# Altium project PCB_Project.PrjPcb (part 2 of 2)

## Sheet Button-connections.SchDoc
size A4; SheetNumber: 5; SheetTotal: 6
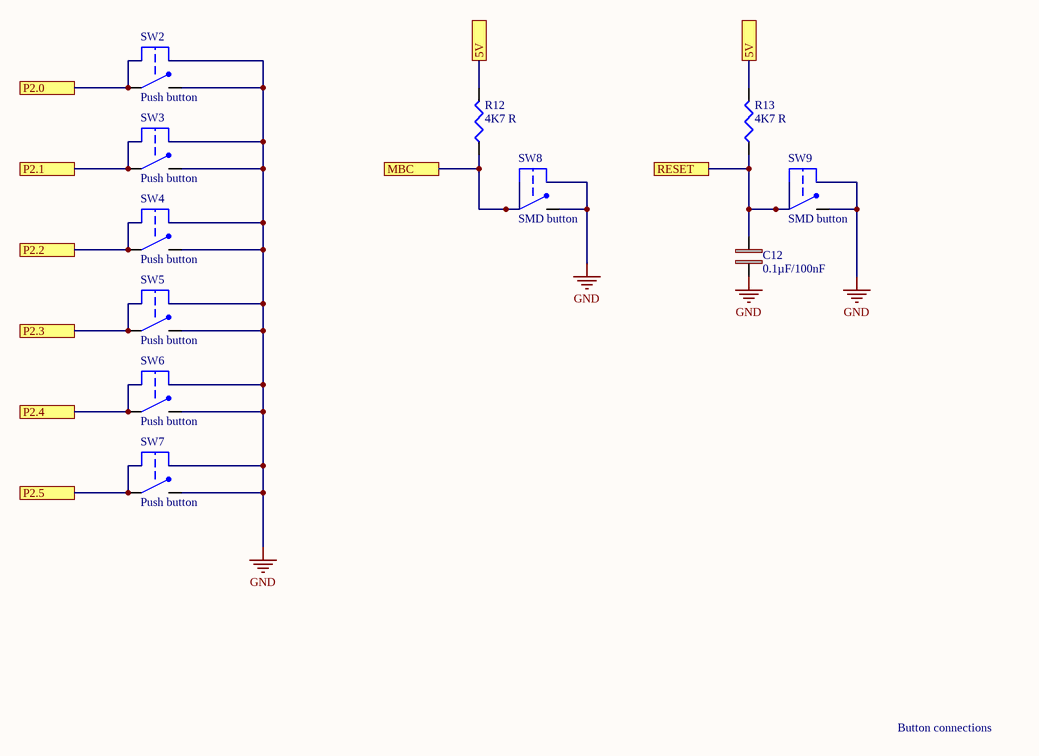
[diagram p4: Button-connections.SchDoc]

### Parts
C12  0.1µF/100nF  [MC0603B104K250CT]
R12  4K7 R  [PCF0603]
R13  4K7 R  [PCF0603]
SW2  Push button  [Tactile button]
SW3  Push button  [Tactile button]
SW4  Push button  [Tactile button]
SW5  Push button  [Tactile button]
SW6  Push button  [Tactile button]
SW7  Push button  [Tactile button]
SW8  SMD button  [TACTILE BUTTON - duplicate]
SW9  SMD button  [TACTILE BUTTON - duplicate]

### Ports
5V, MBC, P2.0, P2.1, P2.2, P2.3, P2.4, P2.5, RESET

### Nets
GND: C12.2 SW2.3 SW2.4 SW3.3 SW3.4 SW4.3 SW4.4 SW5.3 SW5.4 SW6.3 SW6.4 SW7.3 SW7.4 SW8.3 SW8.4 SW9.3 SW9.4
NetC4_1: R12.2 R13.2 ; port 5V
NetC12_1: C12.1 R13.1 SW9.1 SW9.2 ; port RESET
NetIC6_22: SW2.1 SW2.2 ; port P2.0
NetIC6_23: SW3.1 SW3.2 ; port P2.1
NetIC6_24: SW4.1 SW4.2 ; port P2.2
NetIC6_27: SW5.1 SW5.2 ; port P2.3
NetIC6_28: SW6.1 SW6.2 ; port P2.4
NetIC6_29: SW7.1 SW7.2 ; port P2.5
NetIC6_58: R12.1 SW8.1 SW8.2 ; port MBC

### Notes on the sheet
- Button connections

### Library data of the parts
C12 = MC0603B104K250CT: Cap Ceramic 0.1uF 25V X7R 10% Pad SMD 0603 125C T/R; Manufacturer: Multicomp; Capacitance: 100nF; Supplier 1: Newark; Manufacturer Part Number: MC0603B104K250CT; RoHS: Yes; Category: Ceramic Capacitors; Stock 1: 124000; Pricing 1: 1=0,00300, 4000=0,00300, 8000=0,00300, 20000=0,00300 (USD); Case/Package: 0603; Number of Pins: 2; Case Code (Metric): 1608; Case Code (Imperial): 0603; Min Operating Temperature: -55°C; Max Operating Temperature: 125°C; Tolerance: 10%; Packaging: Cut Tape; Voltage Rating: 25V; Dielectric: X7R; Voltage Rating (DC): 25V; Series: MLCC; Width: 0.8mm; REACH SVHC: Unknown; RoHS Compliant: Yes; ComponentLink1URL: https://datasheet.ciiva.com/22686/1901289-22686277.pdf?src-supplier=Element14; ComponentLink1Description: https://datasheet.ciiva.com/22686/1901289-22686277.pdf?src-supplier=Element14; ComponentLink2URL: https://datasheet.ciiva.com/22648/1901289-22648410.pdf?src-supplier=Element14; ComponentLink2Description: https://datasheet.ciiva.com/22648/1901289-22648410.pdf?src-supplier=Element14; Supplier Part Number 1: 94W8728
R12 R13 = PCF0603P-R-4K7-BT1: Surface Mount Metal Film Resistor, Pcf Series, 4.7 Kohm, 63 Mw, - 0.1%, 75 V Rohs Compliant: Yes; Manufacturer: TT Welwyn; Power Rating: 63mW; Voltage Rating: 75V; Resistance: 4.7kR; Temperature Coefficient: 25ppm/°C; Case/Category: 0603; Supplier 1: Newark; Manufacturer Part Number: PCF0603P-R-4K7-BT1; RoHS: Yes; Category: Chip SMD Resistors; Stock 1: 1027; Pricing 1: 10=0,17900 (USD); Case Code (Imperial): 0603; Case Code (Metric): 1608; Tolerance: 0.1%; Packaging: Cut Tape; Resistor Type: Thin Film; Voltage Rating (DC): 75V; REACH SVHC: No SVHC; ComponentLink1URL: https://datasheet.ciiva.com/7860/3754-7860191.pdf?src-supplier=Element14; ComponentLink1Description: https://datasheet.ciiva.com/7860/3754-7860191.pdf?src-supplier=Element14; ComponentLink2URL: https://datasheet.ciiva.com/6093/3754-6093381.pdf?src-supplier=Farnell; ComponentLink2Description: https://datasheet.ciiva.com/6093/3754-6093381.pdf?src-supplier=Farnell; Supplier Part Number 1: 61M8292
SW2-SW7 = EVQ-PAG05R: Switch Tactile N.O. SPST Round Button PC Pins 0.02A 15VDC 2.6N Thru-Hole Bulk; Manufacturer: Panasonic; Mechanical Life: 50000Cycles; Actuator Color: Red; Max Voltage Rating (DC): 15V; Illumination Type: Non-Illuminated; Switch Function: Off-Mom; Actuator Type: Standard; Current Rating: 20mA; Contact Resistance: 50mR; Switch Travel: 0.25mm; Actuator Length: 1.6mm; Supplier 1: RSComponents; Manufacturer Part Number: EVQ-PAG05R; RoHS: Yes; Category: Tactile Switches; Stock 1: 1; Pricing 1: 50=0,24100, 500=0,18100 (USD); Mount: Through Hole; Contact Plating: Silver; Min Operating Temperature: -20°C; Max Operating Temperature: 70°C; Throw Configuration: SPST; Packaging: Bulk; Operating Force: 2.6N; Package Quantity: 500; Termination: PC Pin; Voltage Rating (DC): 15V; Max Current Rating: 20mA; Contact Current Rating: 20mA; Electrical Life: 50000Cycles; Orientation: Straight; Series: EVQPA; Length: 6mm; Width: 6mm; Height: 5mm; Depth: 6.5mm; Size: 6mm; Radiation Hardening: No; Lead Free: Lead Free; REACH SVHC: No SVHC; RoHS Compliant: Yes; ComponentLink1URL: https://datasheet.ciiva.com/1634/1520560-1634709.pdf?src-supplier=Farnell; ComponentLink1Description: https://datasheet.ciiva.com/1634/1520560-1634709.pdf?src-supplier=Farnell; ComponentLink2URL: https://datasheet.ciiva.com/25603/0900766b810ad3e5-25603994.pdf?src-supplier=RSComponents; ComponentLink2Description: https://datasheet.ciiva.com/25603/0900766b810ad3e5-25603994.pdf?src-supplier=RSComponents; ComponentLink3URL: https://datasheet.ciiva.com/1532/1520560-1532790.pdf?src-supplier=Element14; ComponentLink3Description: https://datasheet.ciiva.com/1532/1520560-1532790.pdf?src-supplier=Element14; ComponentLink4URL: https://datasheet.ciiva.com/24086/atk0000ce10-33274-24086442.pdf?src-supplier=Mouser; ComponentLink4Description: https://datasheet.ciiva.com/24086/atk0000ce10-33274-24086442.pdf?src-supplier=Mouser; ComponentLink5URL: https://datasheet.ciiva.com/2901/atk0000ce10-2901437.pdf?src-supplier=Digi-Key; ComponentLink5Description: https://datasheet.ciiva.com/2901/atk0000ce10-2901437.pdf?src-supplier=Digi-Key; ComponentLink6URL: https://datasheet.ciiva.com/30192/36atk0000ce10-30192373.pdf?src-supplier=Onlinecomponents.com; ComponentLink6Description: https://datasheet.ciiva.com/30192/36atk0000ce10-30192373.pdf?src-supplier=Onlinecomponents.com; ComponentLink7URL: https://datasheet.ciiva.com/8166/atk0000ce10-8166366.pdf?src-supplier=Avnet; ComponentLink7Description: https://datasheet.ciiva.com/8166/atk0000ce10-8166366.pdf?src-supplier=Avnet; ComponentLink8URL: https://datasheet.ciiva.com/16976/70270700-16976175.pdf?src-supplier=Allied+Electronics; ComponentLink8Description: https://datasheet.ciiva.com/16976/70270700-16976175.pdf?src-supplier=Allied+Electronics; Supplier Part Number 1: 7561543P
SW8 SW9 = EVQ-PLMA15: Switch Tactile N.O. SPST Round Button J-Bend 0.02A 15VDC 2.6N SMD Embossed Tape; Manufacturer: Panasonic; Mechanical Life: 200000Cycles; Max Voltage Rating (DC): 15V; Current Rating: 20mA; Contact Resistance: 50mR; Illumination Type: Non-Illuminated,Illuminated; Switch Travel: 0.25mm; Switch Function: Off-Mom; Actuator Type: Standard; Actuator Length: 0.3mm; Supplier 1: Newark; Manufacturer Part Number: EVQ-PLMA15; RoHS: Yes; Category: Tactile Switches; Stock 1: 5000; Pricing 1: 1=0,18600, 5000=0,18600, 10000=0,18000, 25000=0,17700, 50000=0,17500 (USD); Mount: Surface Mount; Contact Plating: Gold,Silver; Min Operating Temperature: -20°C; Max Operating Temperature: 70°C; Throw Configuration: SPST; Operating Force: 2.6N; Termination: J-Bend; Voltage Rating (DC): 15V; Packaging: Tape and Reel; Package Quantity: 1; Max Current Rating: 20mA; Electrical Life: 200000Cycles; Orientation: Straight; Contact Current Rating: 20mA; Voltage Rating: 15V; Insulation Resistance: 50MR; Length: 4.9mm; Width: 4.9mm; Height: 1.5mm; Depth: 4.9mm; Radiation Hardening: No; REACH SVHC: No SVHC; Lead Free: Lead Free; ComponentLink1URL: https://datasheet.ciiva.com/8164/atv0000ce2-8164994.pdf?src-supplier=Avnet; ComponentLink1Description: https://datasheet.ciiva.com/8164/atv0000ce2-8164994.pdf?src-supplier=Avnet; ComponentLink2URL: https://datasheet.ciiva.com/16205/atk0000ce3-16205767.pdf?src-supplier=Future+Electronics; ComponentLink2Description: https://datasheet.ciiva.com/16205/atk0000ce3-16205767.pdf?src-supplier=Future+Electronics; ComponentLink3URL: https://datasheet.ciiva.com/17065/70270715-17065721.pdf?src-supplier=Allied+Electronics; ComponentLink3Description: https://datasheet.ciiva.com/17065/70270715-17065721.pdf?src-supplier=Allied+Electronics; ComponentLink4URL: https://datasheet.ciiva.com/2899/atk0000ce3-2899834.pdf?src-supplier=Digi-Key; ComponentLink4Description: https://datasheet.ciiva.com/2899/atk0000ce3-2899834.pdf?src-supplier=Digi-Key; ComponentLink5URL: https://datasheet.ciiva.com/2899/atk0000ce3-2899835.pdf?src-supplier=Digi-Key; ComponentLink5Description: https://datasheet.ciiva.com/2899/atk0000ce3-2899835.pdf?src-supplier=Digi-Key; ComponentLink6URL: https://datasheet.ciiva.com/2899/atk0000ce3-2899836.pdf?src-supplier=Digi-Key; ComponentLink6Description: https://datasheet.ciiva.com/2899/atk0000ce3-2899836.pdf?src-supplier=Digi-Key; ComponentLink7URL: https://datasheet.ciiva.com/26827/getdatasheetpartid-51835-26827884.pdf?src-supplier=Verical; ComponentLink7Description: https://datasheet.ciiva.com/26827/getdatasheetpartid-51835-26827884.pdf?src-supplier=Verical; Supplier Part Number 1: 27AC5577

## Sheet Interfaces.SchDoc
size A4; SheetNumber: 6; SheetTotal: 6
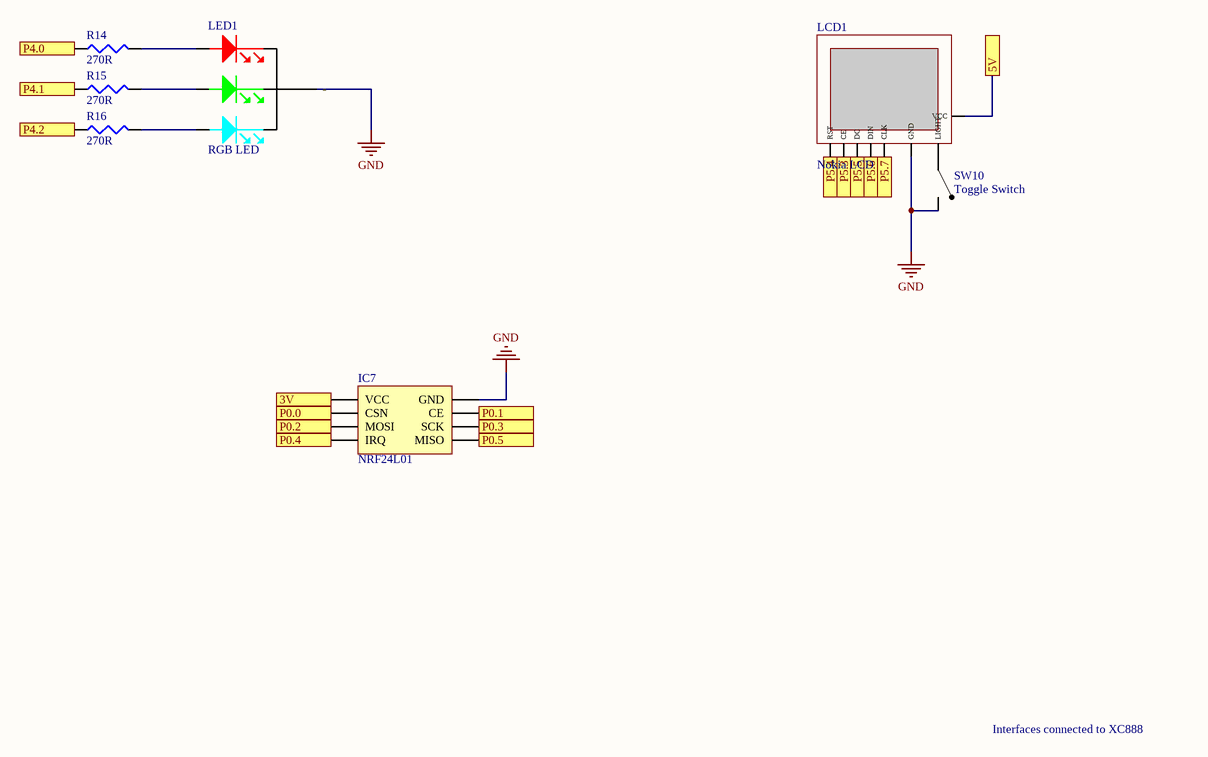
[diagram p5: Interfaces.SchDoc]

### Parts
IC7  NRF24L01  [NRF header]
LCD1  Nokia LCD  [LCD header]
LED1  RGB LED  [4 PIN - RGB LED]
R14  270R  [CRG0402F]
R15  270R  [CRG0402F]
R16  270R  [CRG0402F]
SW10  Toggle Switch  [SMD Switch]

### Ports
3V, 5V, P0.0, P0.1, P0.2, P0.3, P0.4, P0.5, P4.0, P4.1, P4.2, P5.3, P5.4, P5.5, P5.6, P5.7

### Nets
GND: IC7.2(GND) LCD1.8(GND) LED1.2(-) SW10.2
NetBAT_1: IC7.1(VCC) ; port 3V
NetC4_1: LCD1.6(VCC) ; port 5V
NetIC6_1: IC7.8(MISO) ; port P0.5
NetIC6_13: LCD1.2(CE) ; port P5.3
NetIC6_14: LCD1.1(RST) ; port P5.4
NetIC6_15: LCD1.3(DC) ; port P5.5
NetIC6_17: IC7.3(CSN) ; port P0.0
NetIC6_18: IC7.5(MOSI) ; port P0.2
NetIC6_19: LCD1.4(DIN) ; port P5.6
NetIC6_20: LCD1.5(CLK) ; port P5.7
NetIC6_21: IC7.4(CE) ; port P0.1
NetIC6_59: R14.1 ; port P4.0
NetIC6_60: R15.1 ; port P4.1
NetIC6_61: R16.1 ; port P4.2
NetIC6_63: IC7.6(SCK) ; port P0.3
NetIC6_64: IC7.7(IRQ) ; port P0.4
NetLCD1_7: LCD1.7(LIGHT) SW10.1
NetLED1_1: LED1.1 R16.2
NetLED1_3: LED1.3 R15.2
NetLED1_4: LED1.4 R14.2

### Notes on the sheet
- Interfaces connected to XC888

### Library data of the parts
IC7 = NRF24L01 Module
LCD1 = Nokia 5110 LCD: Category: LCD Display
LED1 = WP154A4SUREQBFZGC: Hyper Red/Green/Blue 50º Water Clear Full Color LED Lamp - T-1 3/4; Manufacturer: Kingbright; Color: Blue,Green,Red; Forward Voltage: 4V; Viewing Angle: 60°; Luminous Intensity: 500mcd; Lens Style: Dome; Test Current: 20mA; Dominant Wavelength: 465nm; Power Rating: 120mW; Reverse Voltage (DC): 5V; Supplier 1: Digi-Key; Manufacturer Part Number: WP154A4SUREQBFZGC; RoHS: Yes; Category: LEDs; Stock 1: 39551; Pricing 1: 1=1,98000, 10=1,25100, 100=0,92560, 500=0,85054, 1000=0,70800 (USD); Mount: Through Hole; Case/Package: Radial; Weight: 0.01411oz; Min Operating Temperature: -40°C; Max Operating Temperature: 85°C; Packaging: Bulk; Package Quantity: 500; Forward Current: 20mA; Lens Transparency: Clear; Operating Supply Voltage: 4V; Height: 8.6mm; RoHS Compliant: Yes; Lead Free: Lead Free; ComponentLink1URL: https://datasheet.ciiva.com/6349/wp154a4sureqbfzgc-6349426.pdf?src-supplier=Digi-Key; ComponentLink1Description: https://datasheet.ciiva.com/6349/wp154a4sureqbfzgc-6349426.pdf?src-supplier=Digi-Key; ComponentLink2URL: https://datasheet.ciiva.com/13501/wp154a4sureqbfzgc-194997-13501708.pdf?src-supplier=Mouser; ComponentLink2Description: https://datasheet.ciiva.com/13501/wp154a4sureqbfzgc-194997-13501708.pdf?src-supplier=Mouser; Supplier Part Number 1: 754-1615-ND
R14-R16 = CRG0402F270R: Res Thick Film 0402 270 Ohm 1% 0.063W(1/16W) ±100ppm/C Pad SMD T/R; Manufacturer: TE Connectivity; Temperature Coefficient: 100ppm/°C; Max Power Dissipation: 63mW; Voltage Rating: 50V; Number of Resistors: 1; Supplier 1: Newark; Manufacturer Part Number: CRG0402F270R; RoHS: Yes; Category: Chip SMD Resistors; Stock 1: 50238; Pricing 1: 1=0,00500, 10=0,00400, 25=0,00400, 50=0,00400, 100=0,00400 (USD); Mount: Surface Mount; Case/Package: 0402; Case Code (Imperial): 0402; Case Code (Metric): 1005; Weight: 2.3E-05oz; Min Operating Temperature: -55°C; Max Operating Temperature: 125°C; Packaging: Tape and Reel; Resistance: 270R; Tolerance: 1%; Resistor Type: Thick Film; Package Quantity: 10000; Number of Terminations: 2; Series: CRG, Neohm; Power Rating: 63mW; Termination: Solder; Voltage Rating (DC): 50V; Technology: THICK FILM; Resistance Tolerance: 1%; Length: 1mm; Width: 0.5mm; Height: 0.35mm; Depth: 0.5mm; RoHS Compliant: Yes; REACH SVHC: No SVHC; ELV: Compliant; ComponentLink1URL: https://datasheet.ciiva.com/11811/0900766b80d0914d-11811952.pdf?src-supplier=RSComponents; ComponentLink1Description: https://datasheet.ciiva.com/11811/0900766b80d0914d-11811952.pdf?src-supplier=RSComponents; ComponentLink2URL: https://datasheet.ciiva.com/12563/eng-ds-1773204-g-12563015.pdf?src-supplier=Mouser; ComponentLink2Description: https://datasheet.ciiva.com/12563/eng-ds-1773204-g-12563015.pdf?src-supplier=Mouser; ComponentLink3URL: https://datasheet.ciiva.com/22706/1610603-22706089.pdf?src-supplier=Element14; ComponentLink3Description: https://datasheet.ciiva.com/22706/1610603-22706089.pdf?src-supplier=Element14; ComponentLink4URL: https://datasheet.ciiva.com/17122/70063020-17122922.pdf?src-supplier=Allied+Electronics; ComponentLink4Description: https://datasheet.ciiva.com/17122/70063020-17122922.pdf?src-supplier=Allied+Electronics; Supplier Part Number 1: 95W7454
SW10 = SK12D07VG3NS: C&K SK-12D07-VG 3 NS Switches > Slide > Miniature > Mini R/A Slide; Manufacturer: ITT C&K; Supplier 1: Digi-Key; Manufacturer Part Number: SK12D07VG3NS; RoHS: No; Category: Uncategorized; Pricing 1: 30000=0,24375 (USD); Package Quantity: 1000; ComponentLink1URL: http://www.mouser.com/ds/2/60/sk-965380.pdf?src-supplier=Mouser; ComponentLink1Description: http://www.mouser.com/ds/2/60/sk-965380.pdf?src-supplier=Mouser; ComponentLink2URL: https://www.ckswitches.com/media/1432/sk.pdf?src-supplier=Digi-Key; ComponentLink2Description: https://www.ckswitches.com/media/1432/sk.pdf?src-supplier=Digi-Key; Supplier Part Number 1: SK12D07VG3NS-ND

## Nets that join several sheets
GND: Clock-management (C5.2 C6.2 IC4.4 IC4.7), Battery-management (15 pins), FTDI-support (11 pins), XC888 (6 pins), Button-connections (17 pins), Interfaces (IC7.2 LCD1.8 LED1.2 SW10.2)
NetBAT_1: Clock-management (IC4.3), Battery-management (BAT.1 IC1.5 R4.2 SW1.1), Interfaces (IC7.1)
NetC4_1: Clock-management (IC4.8 R8.2 R9.2), Battery-management (C4.1 D1.2 R6.2), XC888 (IC6.7 IC6.25 IC6.55), Button-connections (R12.2 R13.2), Interfaces (LCD1.6)
NetC5_1: Clock-management (C5.1 X2.2), XC888 (IC6.3)
NetC6_1: Clock-management (C6.1 X2.1), XC888 (IC6.4)
NetC12_1: XC888 (IC6.53), Button-connections (C12.1 R13.1 SW9.1 SW9.2)
NetIC4_5: Clock-management (IC4.5 R8.1), XC888 (IC6.49)
NetIC4_6: Clock-management (IC4.6 R9.1), XC888 (IC6.50)
NetIC5_1: FTDI-support (IC5.1), XC888 (IC6.34)
NetIC5_5: FTDI-support (IC5.5), XC888 (IC6.35)
NetIC6_1: XC888 (IC6.1), Interfaces (IC7.8)
NetIC6_13: XC888 (IC6.13), Interfaces (LCD1.2)
NetIC6_14: XC888 (IC6.14), Interfaces (LCD1.1)
NetIC6_15: XC888 (IC6.15), Interfaces (LCD1.3)
NetIC6_17: XC888 (IC6.17), Interfaces (IC7.3)
NetIC6_18: XC888 (IC6.18), Interfaces (IC7.5)
NetIC6_19: XC888 (IC6.19), Interfaces (LCD1.4)
NetIC6_20: XC888 (IC6.20), Interfaces (LCD1.5)
NetIC6_21: XC888 (IC6.21), Interfaces (IC7.4)
NetIC6_22: XC888 (IC6.22), Button-connections (SW2.1 SW2.2)
NetIC6_23: XC888 (IC6.23), Button-connections (SW3.1 SW3.2)
NetIC6_24: XC888 (IC6.24), Button-connections (SW4.1 SW4.2)
NetIC6_27: XC888 (IC6.27), Button-connections (SW5.1 SW5.2)
NetIC6_28: XC888 (IC6.28), Button-connections (SW6.1 SW6.2)
NetIC6_29: XC888 (IC6.29), Button-connections (SW7.1 SW7.2)
NetIC6_58: XC888 (IC6.58), Button-connections (R12.1 SW8.1 SW8.2)
NetIC6_59: XC888 (IC6.59), Interfaces (R14.1)
NetIC6_60: XC888 (IC6.60), Interfaces (R15.1)
NetIC6_61: XC888 (IC6.61), Interfaces (R16.1)
NetIC6_63: XC888 (IC6.63), Interfaces (IC7.6)
NetIC6_64: XC888 (IC6.64), Interfaces (IC7.7)